# EAGLE design fp_js110 (EAGLE 9.6.2)
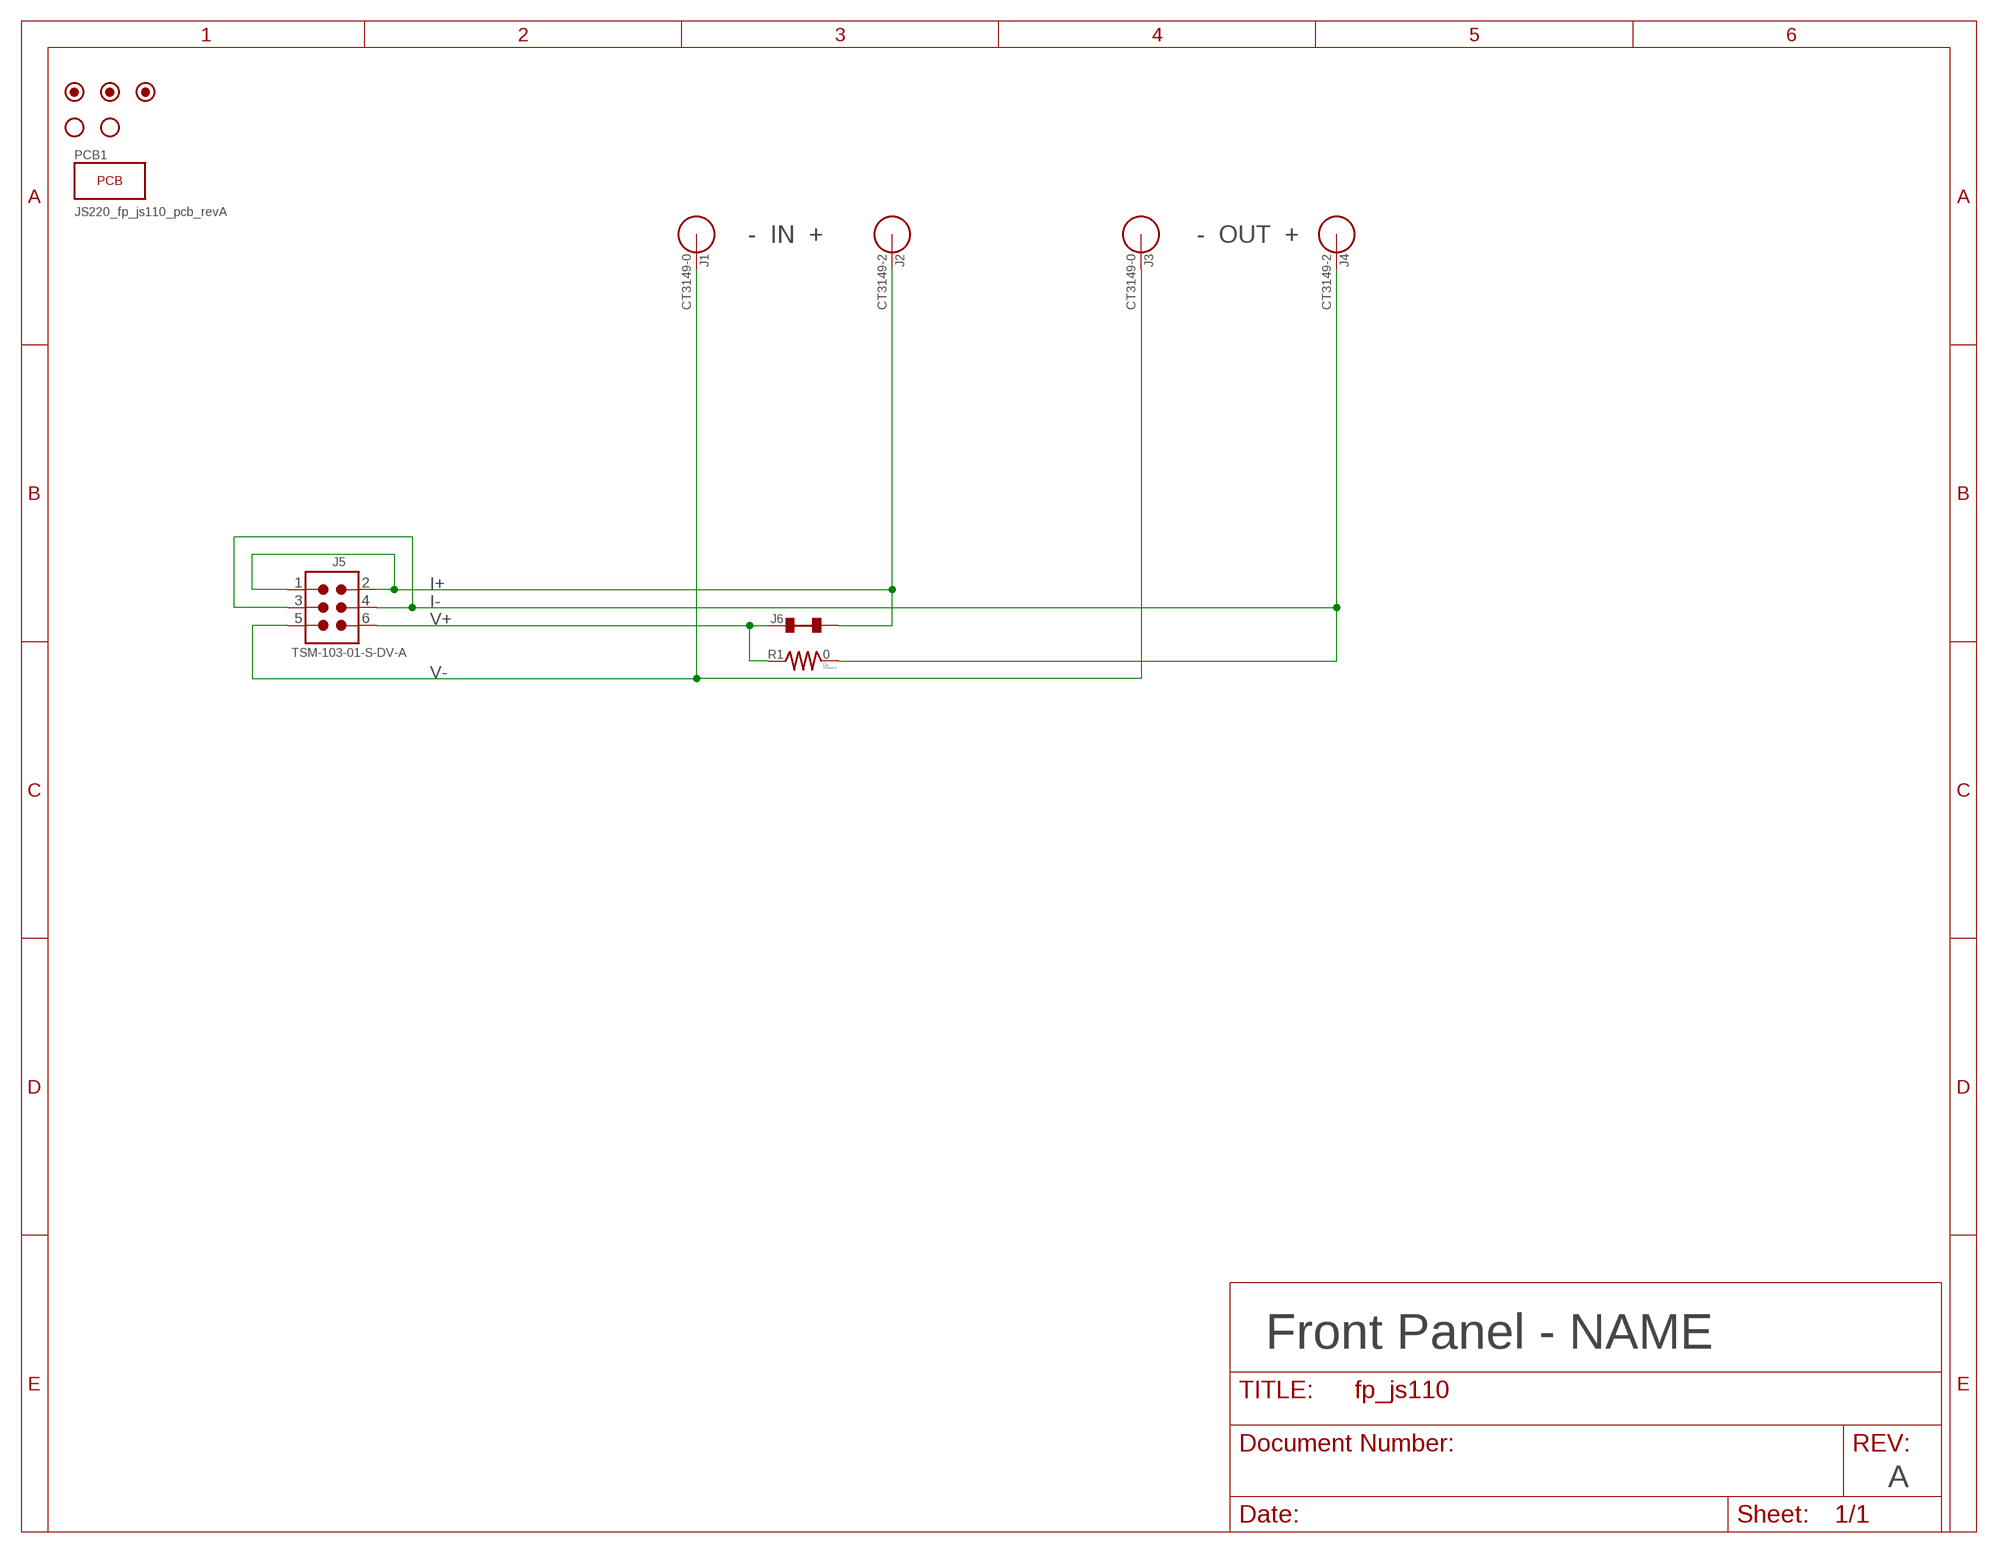
[diagram p0: schematic, sheet 1]
PCB1 (PCB): POPULATE: 1

## Parts
FUD1  FIDUCIAL_1MM  [FIDUCIAL_1MM_2MM]
FUD2  FIDUCIAL_1MM  [FIDUCIAL_1MM_2MM]
FUD3  FIDUCIAL_1MM  [FIDUCIAL_1MM_2MM]
H1  HOLE_#6_NORESTRICT  [HOLE_3.5MM_NORESTRICT]
H2  HOLE_#6_NORESTRICT  [HOLE_3.5MM_NORESTRICT]
J1  CT3149-0  BANANA-JACK_CT3149  [CT3149]
J2  CT3149-2  BANANA-JACK_CT3149  [CT3149]
J3  CT3149-0  BANANA-JACK_CT3149  [CT3149]
J4  CT3149-2  BANANA-JACK_CT3149  [CT3149]
J5  TSM-103-01-S-DV-A  CONN_0.1_3X2_MSA  [CONN_0.1_3X2_MSA]
J6  TRACE_CUT0603  [J0603]
R1  0  RESISTOR_0603  [0603]

## Nets
I+: J2.A J5.1 J5.2 J6.2
I-: J4.A J5.3 J5.4 R1.2
V+: J5.6 J6.1 R1.1
V-: J1.A J3.A J5.5

## Notes on the sheet
- -  IN  + | -  OUT  +
- Front Panel - NAME
- A

## Library data of the parts
FUD1-FUD3 = jetperch:FIDUCIAL; POPULATE: 0
H1 H2 = jetperch:HOLE; POPULATE: 0
J1-J4 = jetperch:BANANA-JACK; POPULATE: 1
J5 = jetperch:CONN_0.1_3X2; MPN: TSM-103-01-S-DV-A; POPULATE: 1
J6 = jetperch:TRACE_CUT: A 2-terminal "device" that is connected by default with a trace. During development and debug, the trace can be cut and a part installed.; POPULATE: 0
R1 = jetperch:RESISTOR; POPULATE: 0; TEMP_CO: 100 ppm/°C; TOLERANCE: 1%; WATTAGE: 0.1W

## Board
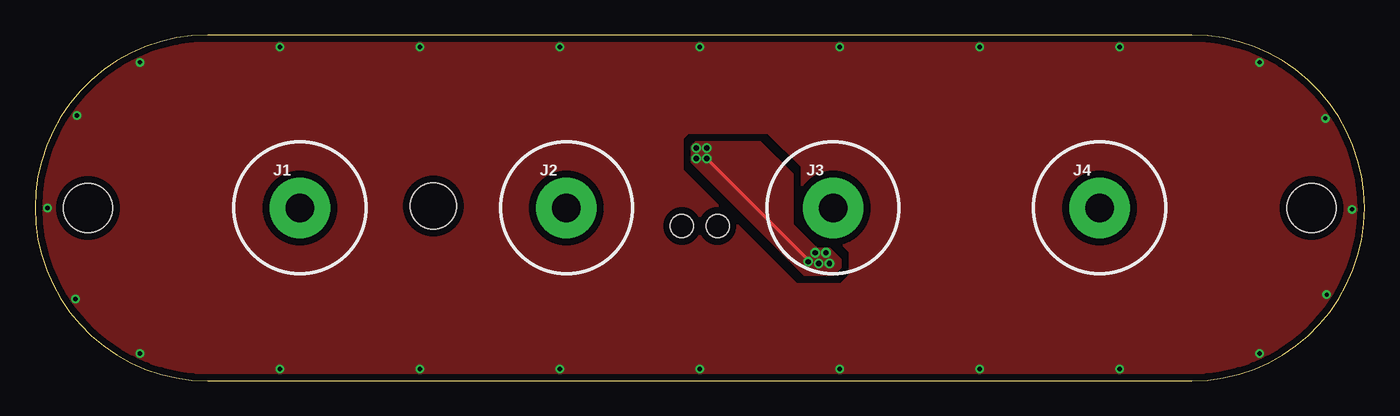
[diagram p1: board, top side]
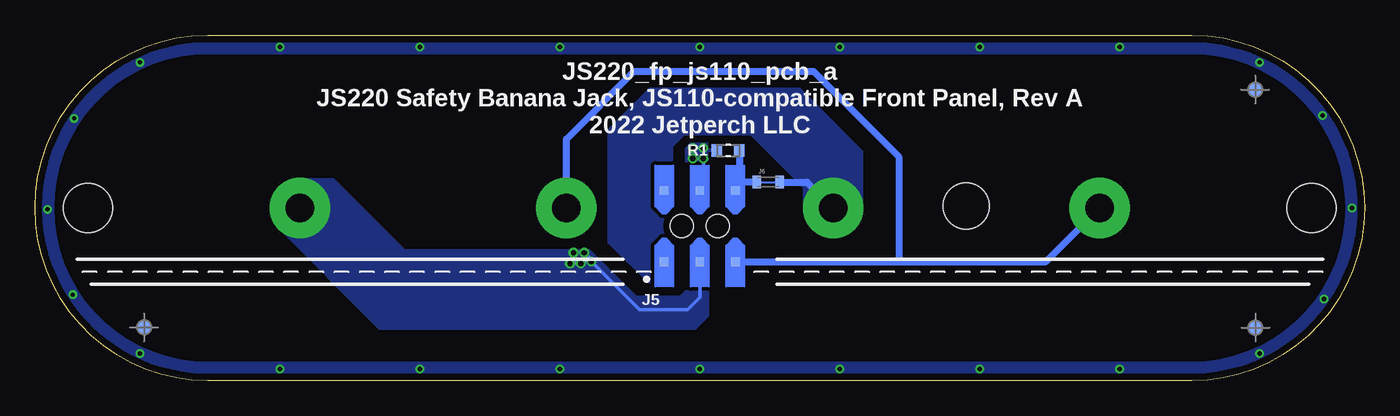
[diagram p2: board, bottom side, seen from below]

Size 95 x 24.7 mm. Coordinates in mm from the lower left corner, seen from the top.
Outline: 0,12.35 arc90 12.35,0 82.65,0 arc90 95,12.35 arc90 82.65,24.7 12.35,24.7 arc90 0,12.35
Copper layers (1*16): Top 0.035mm / dielectric 62mil / Bottom 0.035mm
Design rules "jetperch_2layer *": minimum track width 6mil, minimum drill 12mil, track to track 10mil, track to pad 10mil, pad to pad 10mil, via to via 10mil, smd to smd 0mil, copper to edge 20mil, drill to drill 10mil, minimum pad ring 6mil, minimum via ring 6mil, stop-mask expansion 0mil, vias tented up to drill 15mil, thermal gap 10mil
Holes 3.3 mm at 28.45,12.5

### Footprints (pad centres in the part's own frame; a part is rotated, then mirrored left to right if it is on the bottom)
FIDUCIAL_1MM_2MM = smd 1.016 x 1.016: P1 0,0
HOLE_3.5MM_NORESTRICT = hole 3.5: 0,0
CT3149 = drill 2.032 pad 4.318: A 0,0
CONN_0.1_3X2_MSA = smd 0.635 x 0.635: 1 -2.54,-2.54; 2 -2.54,2.54; 3 0,-2.54; 4 0,2.54; 5 2.54,-2.54; 6 2.54,2.54 | hole 1.651: -1.27,0; 1.27,0
J0603 = smd 0.6 x 0.9: 1 -0.825,0; 2 0.825,0
0603 = smd 0.75 x 0.9: 1 -0.8,0; 2 0.8,0

### Placement (x,y rotation side)
FUD1  7.79,3.79 0 bottom
FUD2  7.81,20.79 0 bottom
FUD3  87.21,3.81 0 bottom
H1  3.79,12.35 0 top
H2  91.21,12.35 0 top
J1  18.93,12.35 0 top
J2  37.98,12.35 0 top
J3  57.02,12.35 0 top
J4  76.08,12.35 0 top
J5  47.5,11.06 0 bottom
J6  42.6,14.2 0 bottom
R1  45.47,16.45 180 bottom

### Tracks (layer width: path | path; a pad name or v marks a point on that pad's centre or on a via)
CGND  (via drill 0.3)
  other vias: 47.5,23.85 57.5,23.85 67.5,23.85 77.5,23.85 37.5,23.85 27.5,23.85 17.5,23.85 17.5,0.85 27.5,0.85 37.5,0.85 47.5,0.85 57.5,0.85 67.5,0.85 77.5,0.85 87.5,22.75 87.5,1.95 94.1,12.25 92.2,18.75 92.3,6.15 7.5,1.95 7.5,22.75 3,18.95 0.9,12.35 2.9,5.85
  pour Top (isolate 0.508, rank 6): 12.35,24.7 82.65,24.7 arc-90 95,12.35 arc-90 82.65,0 12.35,0 arc-90 0,12.35 arc-90
  pour Bottom (isolate 0.254): 48,0 12.35,0 arc-90 0,12.35 arc-90 12.35,24.7 47.5,24.7 47.5,23.45 12.35,23.45 arc90 1.25,12.35 arc90 12.35,1.25 47.5,1.25
  pour Bottom (isolate 0.254): 47.5,0 47.5,1.25 82.65,1.25 arc90 93.75,12.35 arc90 82.65,23.45 47.5,23.45 47.5,24.7 82.65,24.7 arc-90 95,12.35 arc-90 82.65,0
I+
  Bottom 0.508: J6.2 39.83,14.2 J2.A
  pour Bottom (isolate 0.254, no thermals): 35.94,12.19 35.94,16.38 40.39,20.83 51.05,20.83 53.98,17.91 53.98,9.91 50.93,6.86 49.53,6.86 49.53,16.76 48.64,17.65 43.84,17.65 40.01,13.82 40.01,12.19 39.12,11.3 36.83,11.3
I-  (via drill 0.38)
  Top 0.254: v48.01,15.88 55.24,8.64 v55.24,8.51
  Bottom 0.254: J5.4 47.24,13.85 v47.24,15.88 | v47.24,15.88 v47.24,16.64 v48.01,16.64 | v47.24,15.88 v48.01,15.88 | J5.3 47.5,5.97 48.39,5.08 51.82,5.08 v55.24,8.51 | v55.24,8.51 55.24,8.64 v55.75,9.14 v56.52,9.14 | v55.24,8.51 55.88,8.51 v56.01,8.38 v56.77,8.38
  pour Bottom (isolate 0.254): 46.86,14.86 46.86,15.62 46.35,16.13 46.35,16.76 46.48,16.89 48.16,16.89 48.46,16.59 48.46,15.7 48.11,15.34 48.11,15.09 47.88,14.86
  pour Top (isolate 0.254): 46.99,15.62 54.99,7.62 57.02,7.62 57.53,8.13 57.53,8.64 56.77,9.4 55.83,9.4 54.08,11.15 54.08,14.76 51.82,17.02 47.24,17.02 46.99,16.76
  pour Bottom (isolate 0.254, no thermals): 46.94,7.11 46.94,4.65 47.82,3.76 70.37,3.76 77.85,11.25 77.85,12.7 76.18,14.37 73.71,14.37 68.62,9.28 55.41,9.28 52.1,5.97 48.87,5.97 47.73,7.11
V+
  Bottom 0.508: J6.1 44.36,14.2 44.52,14.04 | 44.52,14.04 J5.6 | R1.1 44.67,14.19 44.52,14.04
V-
  Bottom 0.508: J5.5 33.27,8.52 | 33.27,8.52 22.76,8.52 J1.A | J3.A 57.02,17.27 52.2,22.1 39.37,22.1 33.27,16 33.27,8.52

### Text on the board
bNames: JS220_fp_js110_pcb_a / JS220 Safety Banana Jack, JS110-compatible Front Panel, Rev A / 2022 Jetperch LLC
tStop: - | IN | + | - | OUT | + | ±15V / ±3A | Sensor / Status | Isolated / ±48V max to USB ground
Measures: Sensor Status | 2x holes
FabDoc1: All dimensions in millimeters | Place all markings on back (including pcb order number). / Add flammability rating marking on back, such as 94V-0. / The front-side surface is cosmetic - reject units with scratches and blemishes.